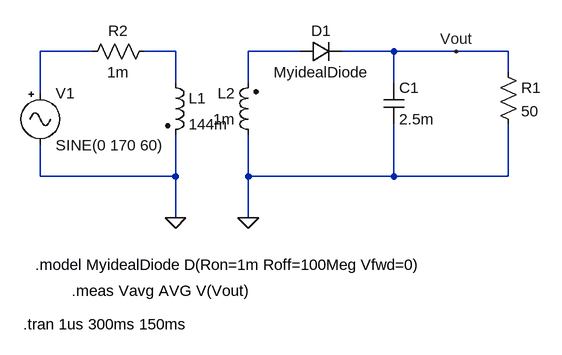
[diagram p0: schematic Lab 5 - Part 2.asc]
Lab 5 - Part 2.asc, the LTspice schematic file:
Version 4
SHEET 1 880 680
WIRE 80 80 0 80
WIRE 208 80 160 80
WIRE 400 80 320 80
WIRE 544 80 464 80
WIRE 640 80 544 80
WIRE 720 80 640 80
WIRE 720 112 720 80
WIRE 208 128 208 80
WIRE 320 128 320 80
WIRE 544 128 544 80
WIRE 0 144 0 80
WIRE 0 272 0 224
WIRE 208 272 208 208
WIRE 208 272 0 272
WIRE 320 272 320 208
WIRE 544 272 544 192
WIRE 544 272 320 272
WIRE 720 272 720 192
WIRE 720 272 544 272
WIRE 208 336 208 272
WIRE 320 336 320 272
FLAG 208 336 0
FLAG 320 336 0
FLAG 640 80 Vout
SYMBOL res 176 64 R90
WINDOW 0 0 56 VBottom 2
WINDOW 3 32 56 VTop 2
SYMATTR InstName R2
SYMATTR Value 1m
SYMBOL ind2 192 112 R0
SYMATTR InstName L1
SYMATTR Value 144m
SYMBOL ind2 336 224 R180
WINDOW 0 36 80 Left 2
WINDOW 3 36 40 Left 2
SYMATTR InstName L2
SYMATTR Value 1m
SYMBOL diode 400 96 R270
WINDOW 0 32 32 VTop 2
WINDOW 3 0 32 VBottom 2
SYMATTR InstName D1
SYMATTR Value MyidealDiode
SYMBOL cap 528 128 R0
SYMATTR InstName C1
SYMATTR Value 2.5m
SYMBOL res 704 96 R0
SYMATTR InstName R1
SYMATTR Value 50
SYMBOL Misc\\signal 0 128 R0
WINDOW 123 0 0 Left 0
WINDOW 39 0 0 Left 0
SYMATTR InstName V1
SYMATTR Value SINE(0 170 60)
TEXT 48 448 Left 2 !.meas Vavg AVG V(Vout)
TEXT -26 500 Left 2 !.tran 1us 300ms 150ms
TEXT -8 408 Left 2 !.model MyidealDiode D(Ron=1m Roff=100Meg Vfwd=0)

The netlist it stands for:
* Lab 5 - Part 2.asc
R2 N002 N001 1m
L1 N002 0 144m
L2 0 N003 1m
D1 N003 Vout MyidealDiode
C1 Vout 0 2.5m
R1 Vout 0 50
V1 N001 0 SINE(0 170 60)
.model D D
.lib standard.dio
.meas Vavg AVG V(Vout)
.tran 1us 300ms 150ms
.model MyidealDiode D(Ron=1m Roff=100Meg Vfwd=0)
.backanno
.end